# EasyEDA schematic PCB_ArduinoShield_v2.json
TITLE: ESP32S3 Shield; REV: 1.1; Date: 2025-01-02; Sheet: 1/1; Company: db robotix
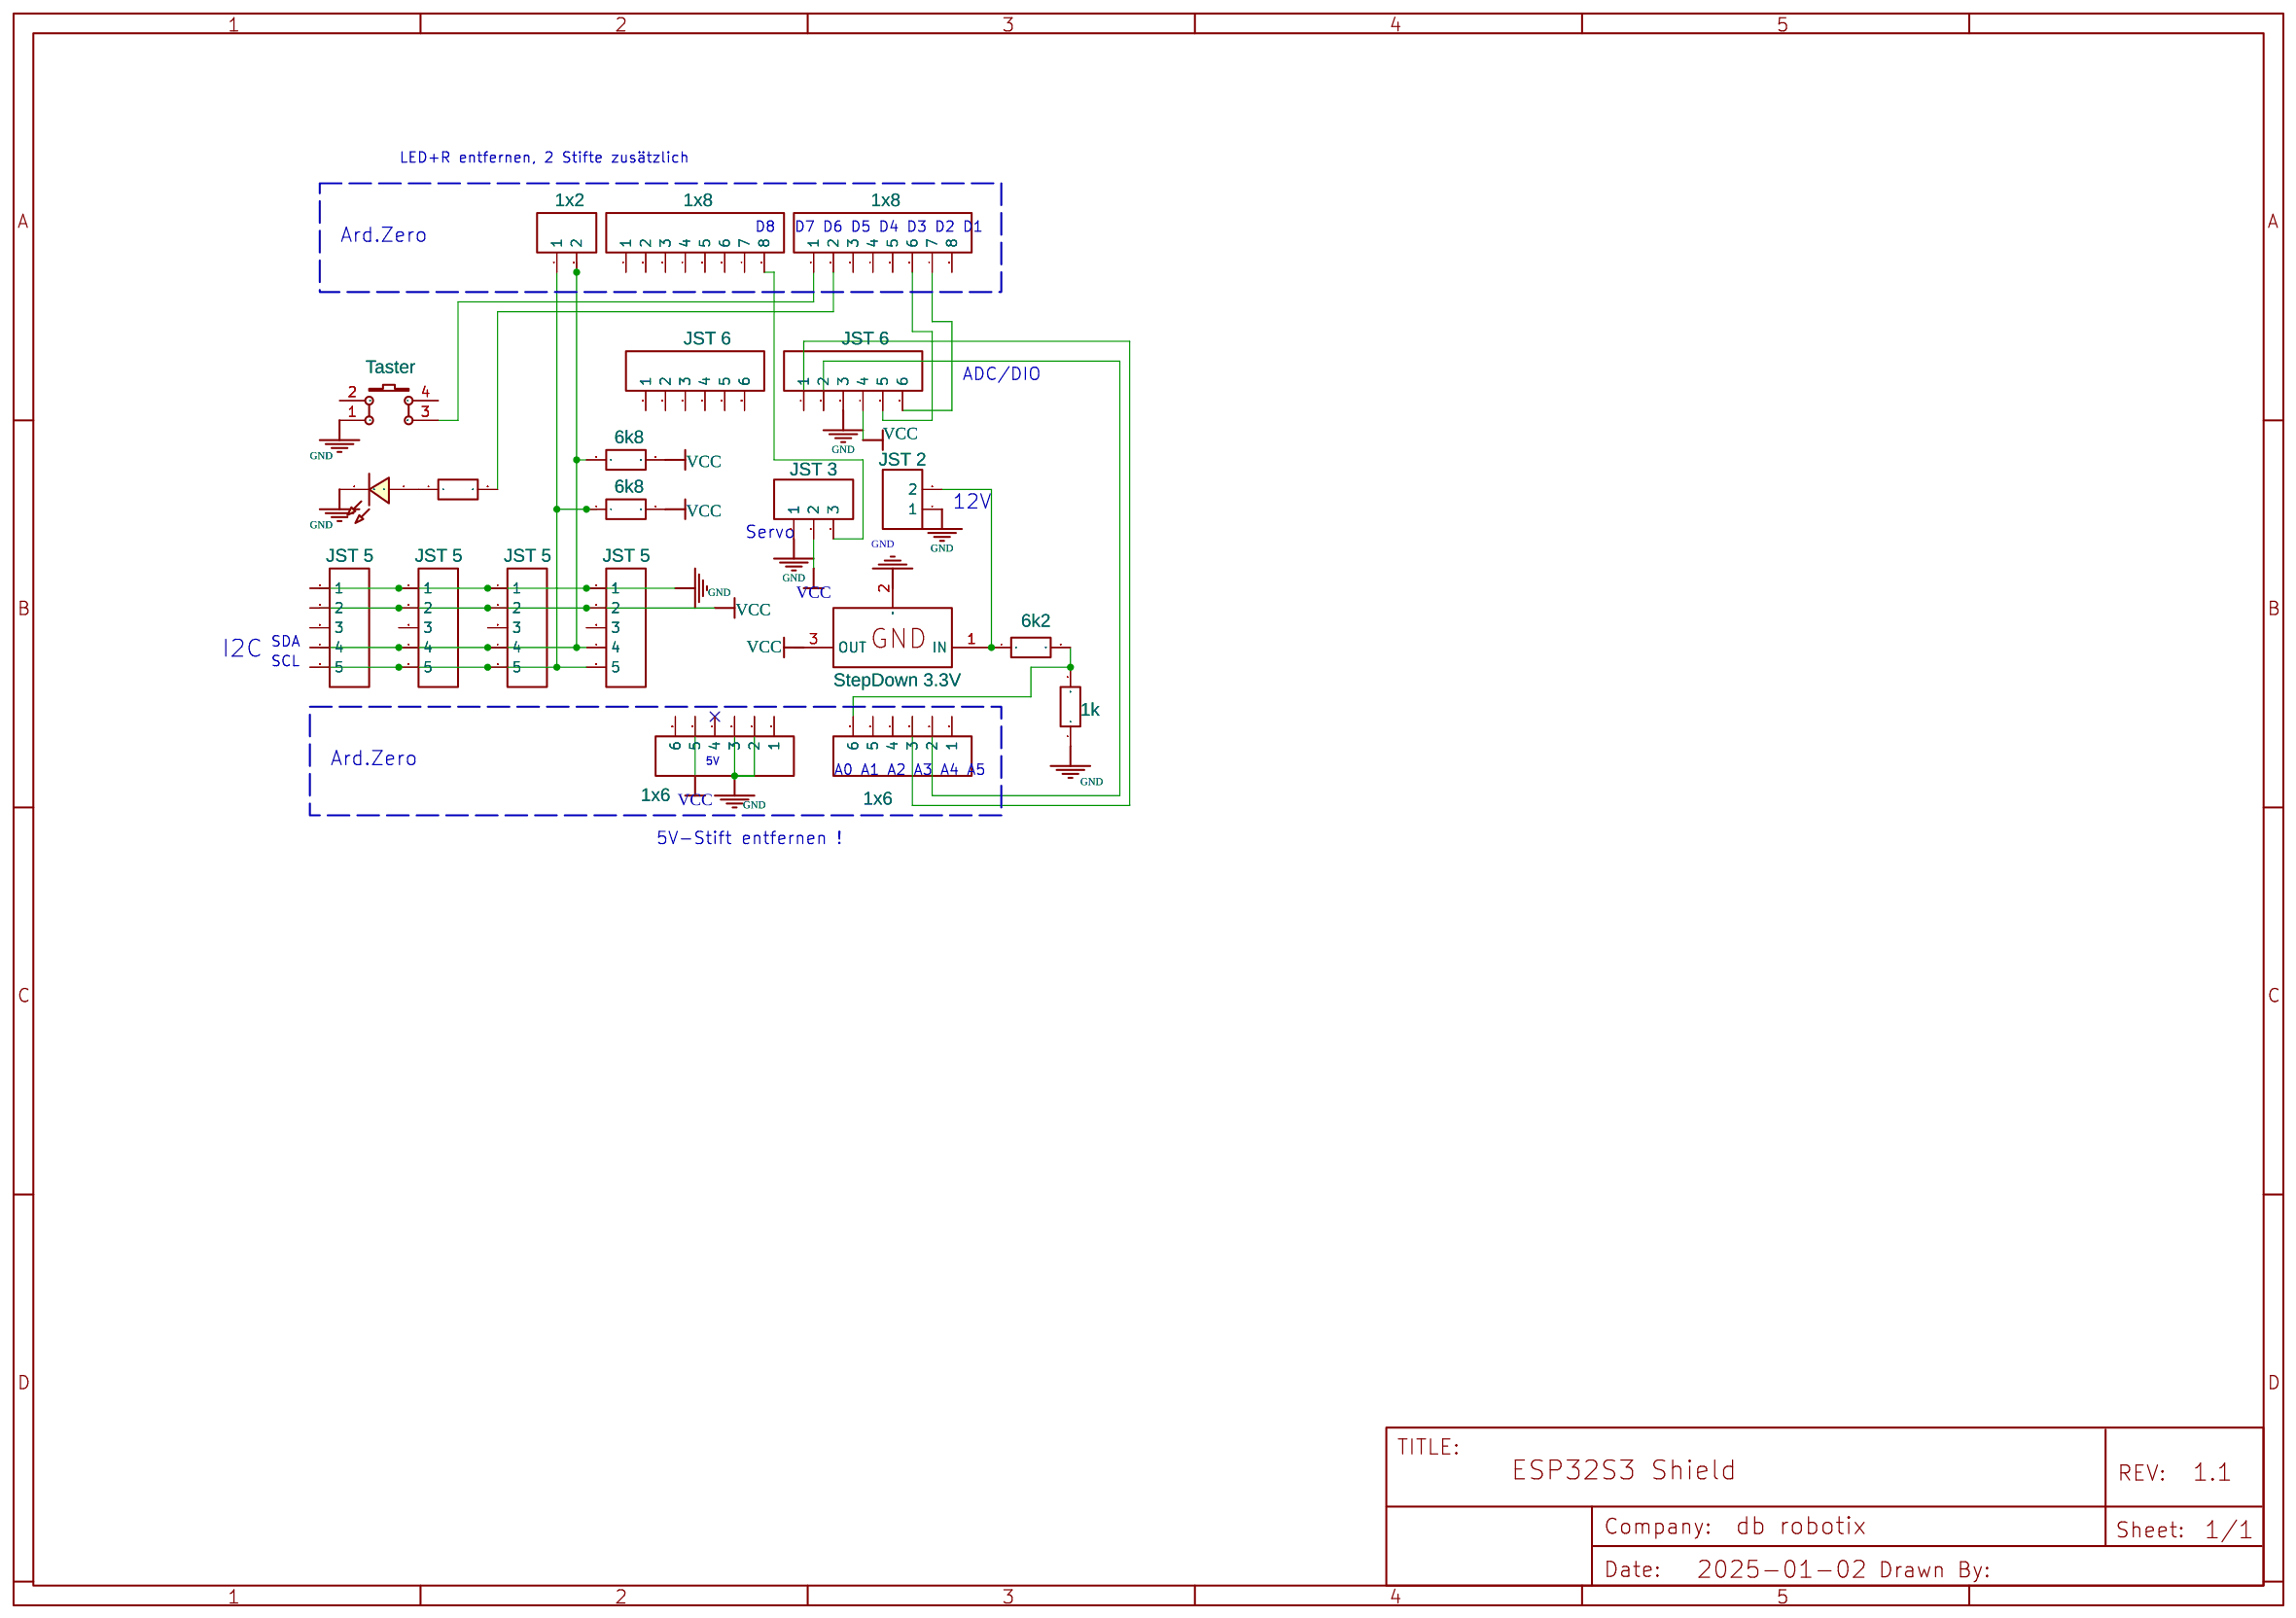
[diagram p0: schematic sheet]

## Parts
H1  1x8  [HDR-F-2.54_1X8]
H2  1x8  [HDR-F-2.54_1X8]
H3  1x2  [HDR-F-2.54_1X2]
H4  1x6  [HDR-F-2.54_1X6]
H5  1x6  [HDR-F-2.54_1X6]
H6  JST 6  [HDR-F-2.54_1X6]
H7  JST 6  [HDR-F-2.54_1X6]
H8  JST 3  [HDR-F-2.54_1X3]
H9  JST 5  [HDR-F-2.54_1X5]
H10  JST 5  [HDR-F-2.54_1X5]
H11  JST 5  [HDR-F-2.54_1X5]
H12  JST 5  [HDR-F-2.54_1X5]
H13  JST 2  [HDR-F-2.54_1X2]
KEY1  Taster  [KEY-TH_4P-L6.0-W6.0-P4.50-LS6.5]
LED1  LED-0603_R  [LED0603_RED]
R1  6k2  [R0603]
R2  1k  [R0603]
R3  1k  [R0603]
R4  6k8  [R0603]
R5  6k8  [R0603]
U1  StepDown 3.3V  [TO-220-3_L10.0-W4.5-P2.54-L]

## Library data of the parts
H1 H2 = HDR-F-2.54_1x8: Supplier Part: C225505; Supplier: LCSC; Contributor: LCEDA_Lib
H3 H13 = HDR-F-2.54_1x2: Supplier Part: C49661; Supplier: LCSC; Contributor: LCEDA_Lib
H4-H7 = HDR-F-2.54_1x6: Supplier Part: C40877; Supplier: LCSC; Contributor: LCEDA_Lib
H8 = HDR-F-2.54_1x3: Supplier Part: C146690; Supplier: LCSC; Contributor: LCEDA_Lib
H9-H12 = HDR-F-2.54_1x5: Supplier Part: C50950; Supplier: LCSC; Contributor: LCEDA_Lib
KEY1 = K4-6×6_TH: Supplier: LCSC; Supplier Part: C136684; Manufacturer: 韩国韩荣; Manufacturer Part: K2-1102DP-E4SW-04; Contributor: LCEDA_Lib
LED1 = LED-0603_R: Manufacturer: EVERLIGHT(台湾亿光); Manufacturer Part: 19-217/R6C-AL1M2VY/3T; Supplier Part: C72044; Supplier: LCSC; Contributor: LCEDA_01
R1-R5 = R_0603_EU: Contributor: LCEDA_Lib
U1 = 7805(TO-220): Supplier: LCSC; Manufacturer: STMicroelectronics; Manufacturer Part: L7805CV-DG; Supplier Part: C3795; Contributor: LCEDA_Lib

## Nets
GND: H5.2 H5.3 H7.3 H8.1 H10.1 H11.1 H12.1 H13.1 KEY1.1 LED1.2 R2.1
VCC: H5.5 H7.4 H8.2 H10.2 H11.2 H12.2 R4.2 R5.2
Net-(H1-1): H1.1 KEY1.3
Net-(H1-2): H1.2 R3.2
Net-(H1-6): H1.6 H7.5
Net-(H1-7): H1.7 H7.6
Net-(H2-8): H2.8 H8.3
Net-(H3-1): H3.1 H10.5 H11.5 H12.5 R5.1
Net-(H3-2): H3.2 H10.4 H11.4 H12.4 R4.1
Net-(H4-2): H4.2 H7.2
Net-(H4-3): H4.3 H7.1
Net-(H4-6): H4.6 R1.2 R2.2
Net-(H13-2): H13.2 R1.1 U1.1(IN)
Net-(LED1-1): LED1.1 R3.1

Not connected (* = marked no-connect by the designer): H1 3 4 5 8; H2 1 2 3 4 5 6 7; H4 1 4 5; H5 1 4* 6; H6 1 2 3 4 5 6; H9 1 2 3 4 5; H10 3; H11 3; H12 3; KEY1 2 4; U1 2(GND) 3(OUT)

## Notes on the sheet
- LED+R entfernen, 2 Stifte zusätzlich
- Ard.Zero
- D8
- D7 D6 D5 D4 D3 D2 D1
- ADC/DIO
- 12V
- Servo
- I2C
- SCL
- SDA
- Ard.Zero
- 5V
- A0 A1 A2 A3 A4 A5
- 5V-Stift entfernen !
